# EasyEDA Pro project ProPrj_蓝牙_KICAD_2026-03-27.epro

# Schematic 蓝牙
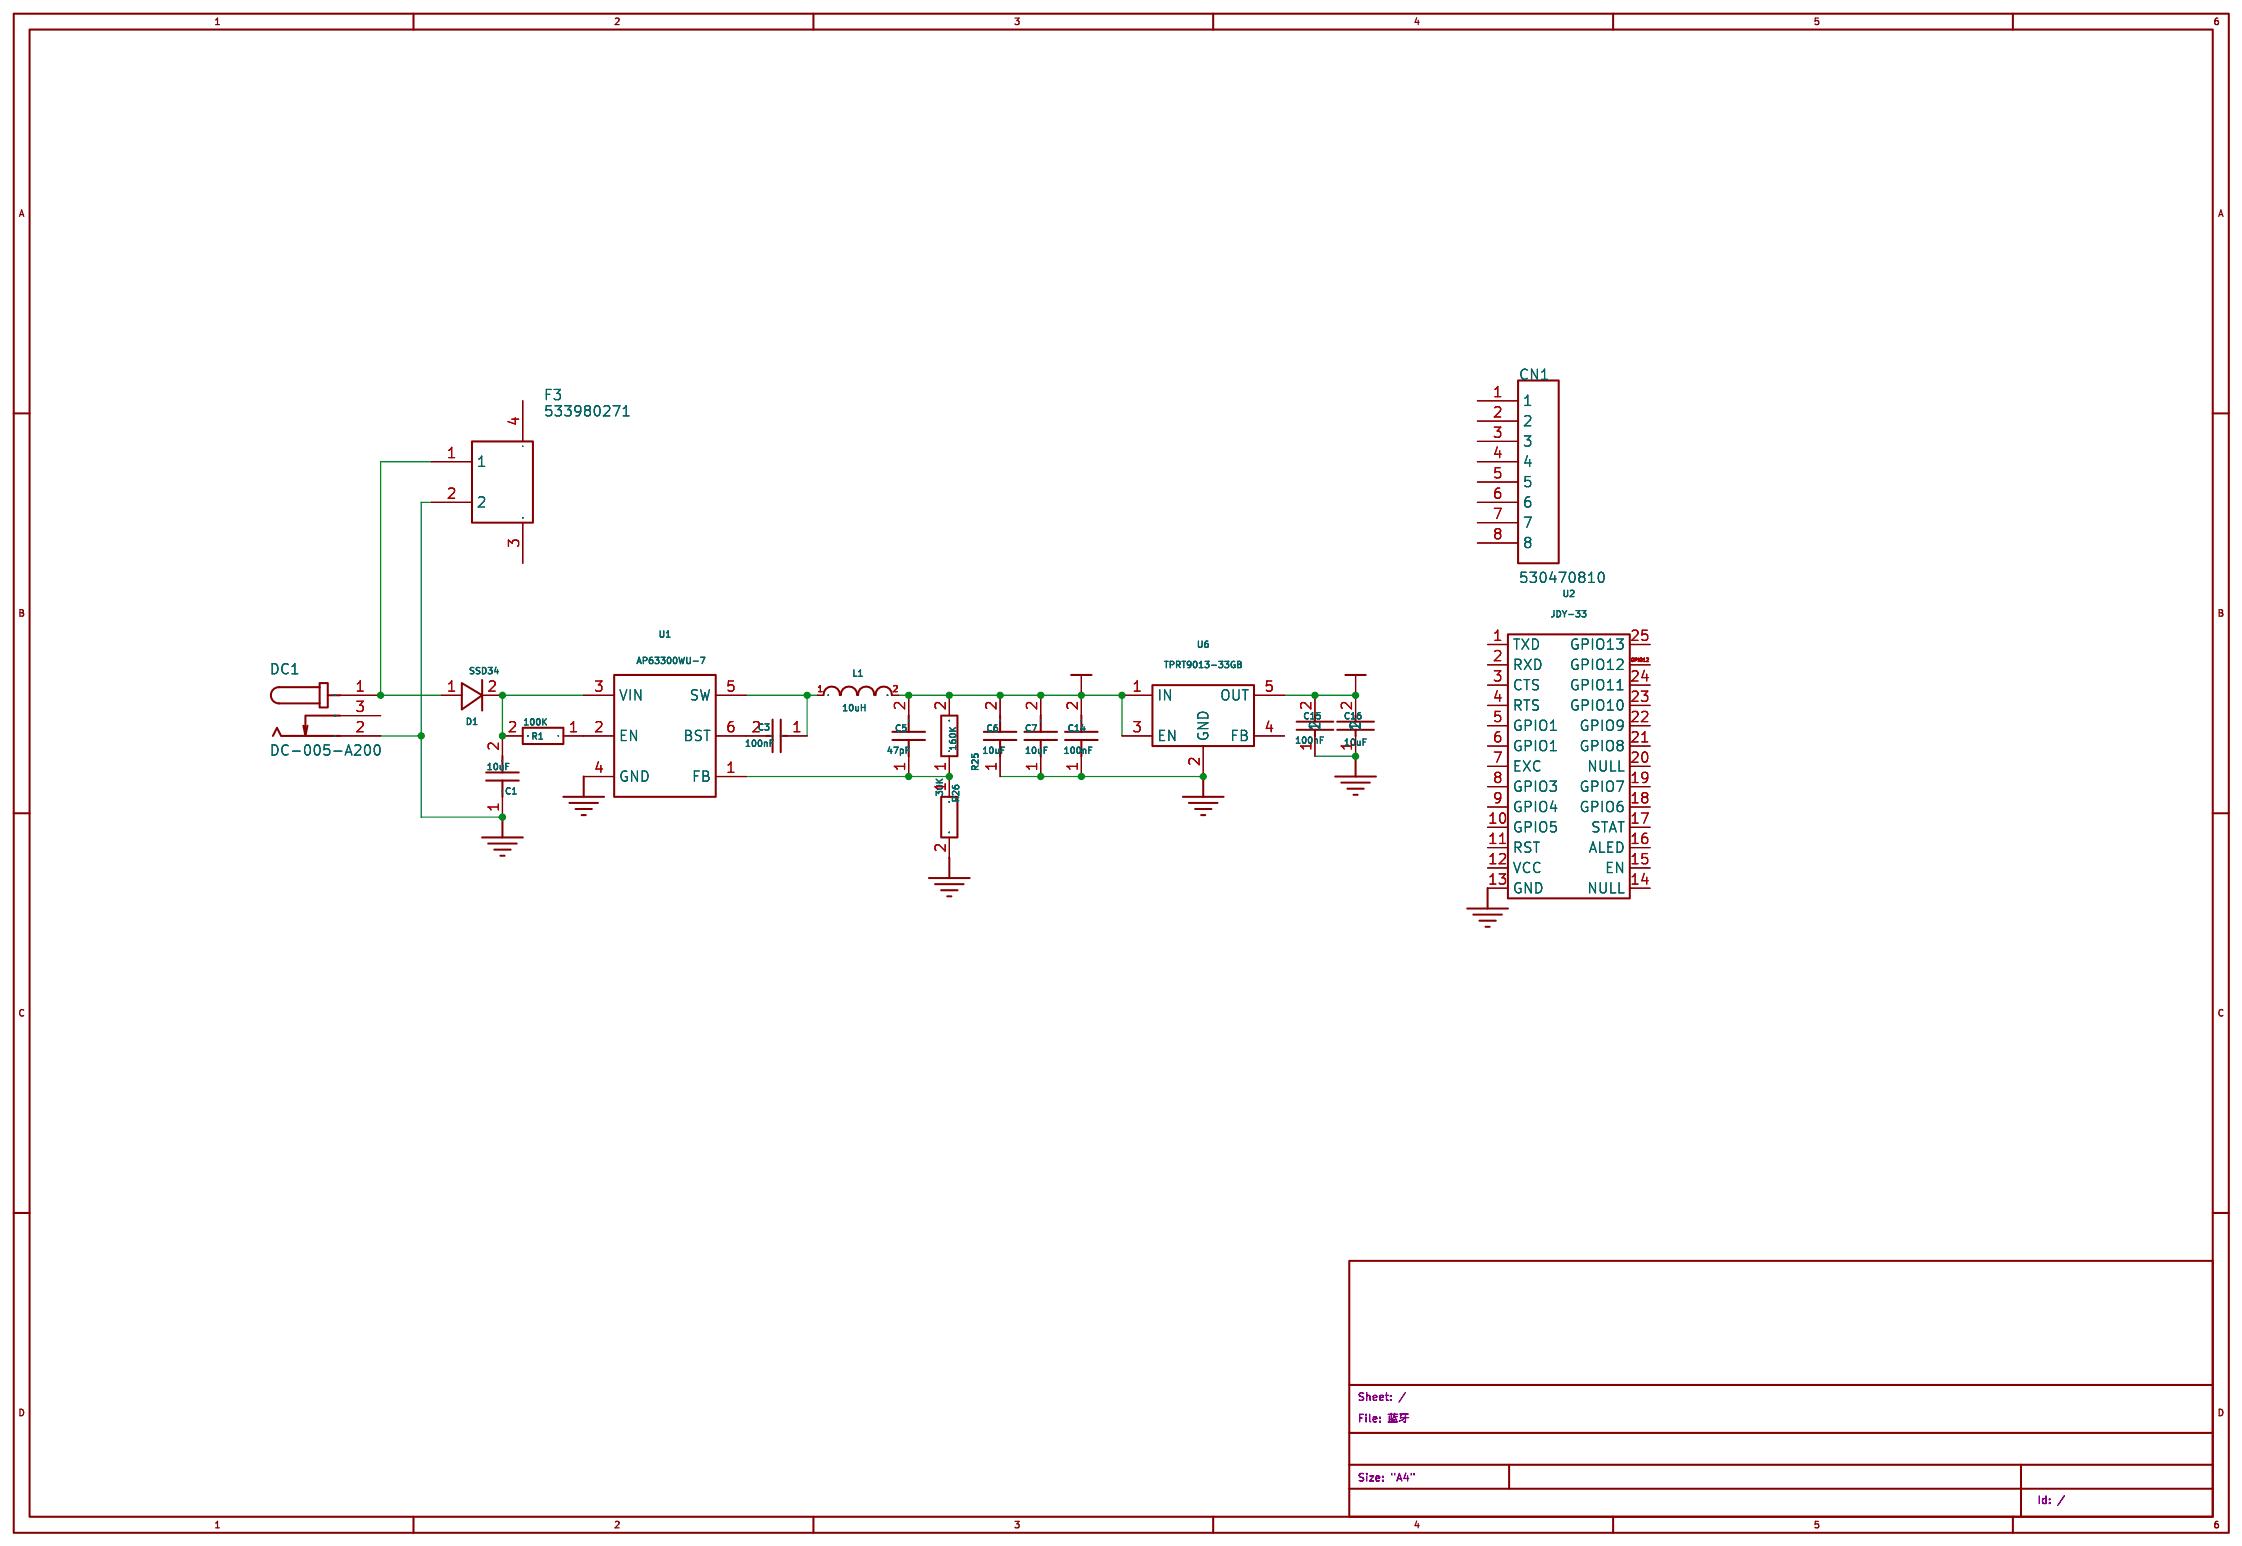
[diagram p0: schematic sheet]

## Parts
C1  10uF
C3  100nF
C5  47pF
C6  10uF
C7  10uF
C14  100nF
C15  100nF
C16  10uF
CN1  530470810  [CONN-TH_8P-P1.25_53047-0810]
D1  SSD34
DC1  DC-005-A200  [DC-IN-TH_DC-005-A200]
F3  533980271  [CONN-SMD_2P-P1.25_053398-0X71]
L1  10uH
R1  100K
R25  160K
R26  30K
U1  AP63300WU-7
U2  JDY-33
U6  TPRT9013-33GB

## Library data of the parts
C1 C5-C7 C14 = P1-altium-import_root_1_22uF_: ORIGIN FOOTPRINT: C0805_S; DEVICE: 22uF; SYMBOL: 22uF; SUPPLIER: LCSC; SUPPLIER PART: C602037; MANUFACTURER: SAMSUNG(三星); MANUFACTURER PART: CL21A226MAYNNNE; JLCPCB PART CLASS: Extended Part; LINK: https://so.szlcsc.com/global.html?k=C602037&amp;ref=editor; CONVERT TO PCB: yes; ADD INTO BOM: yes
C3 = P1-altium-import_root_3_0603B104K500NT_: 容值:100nF;精度:±10%;额定电压:50V;材质(温度系数):X7R;; 容值:100nF;精度:±10%;额定电压:50V;材质(温度系数):X7R;; PIN TYPE: IN; SYMBOL: C0603_S; DEVICE: 0603B104K500NT; CHECK: true; LCSC PART NAME: 100nF ±10% 50V; SUPPLIERPART: C30926; MANUFACTURER: FH(风华); MANUFACTURERPART: 0603B104K500NT; SUPPLIER FOOTPRINT: 0603; JLCPCB PART CLASS: Extended Part; DATASHEET: https://atta.szlcsc.com/upload/public/pdf/source/20200305/C486355_26A10D38EF8C2A5C37091D0039909270.pdf; SUPPLIER: LCSC; ADDINBOM: yes; CONVERTTOPCB: yes; FOOTPRINTNAME: C0603; MODELID: ac125912035d415993ca9572d50418b1; MODELNAME: C0603_L1.6-W0.8-H0.8; MODELTRANSFORM: 62.992,31.496,0,0,0,0,0,0,0; TOLERANCE: ±10%; VOLTAGE RATED: 50V; TEMPERATURE COEFFICIENT: X7R
C15 C16 = Diam_Recv-altium-import_2_C
CN1 = 530470810: 插针结构:1x8P;间距:1.25mm;安装方式:直插;参考系列:PicoBlade(MX 1.25);总PIN数:8P;排数:1;每排PIN数:8;行距:-;额定电流:1A;触头材质:磷青铜;触头镀层:锡;工作温度:-40℃~+85℃;; LCSC Part Name: 1x8P 间距:1.25mm 直插 系列:PicoBlade(MX 1.25); Supplier Part: C240845; Manufacturer: MOLEX; Supplier Footprint: 插件,P=1.25mm; JLCPCB Part Class: Extended Part; Datasheet: https://www.molex.com/content/dam/molex/molex-dot-com/products/automated/en-us/salesdrawingpdf/530/53047/530470810_sd.pdf?inline; Supplier: LCSC; Pins Structure: 1x8P; Pitch: 1.25mm; Mounting Type: 直插; Reference Series: PicoBlade(MX 1.25); Number of Pins: 8P; Number of Rows: 1; Number of PINs Per Row: 8; Current Rating: 1A; Contact Material: 磷青铜; Contact Plating: 锡; Operating Temperature: -40℃~+85℃; Voltage Rating: 125V; Plastic Material: PA; Flame Retardant Rating: UL94V-0; Color: 白色; Z-Height of the Board: 4.2mm; X-Length of Bottom Edge on Board (Spacing Line): 11.75mm; Y-Width of Bottom Edge on Board: 3.2mm
D1 = User_1N4148: 二极管
DC1 = DC-005-A200: 连接器类型:DC电源插座;安装方式:弯插;触点内径:2mm;触点外径:6.4mm;额定电流:3A;额定电压:30V;工作温度:-20℃~+70℃;; LCSC Part Name: DC电源插座 内径:2mm 外径:6.4mm; Supplier Part: C720557; Manufacturer: XUNPU(讯普); Supplier Footprint: 插件; JLCPCB Part Class: Extended Part; Datasheet: https://item.szlcsc.com/datasheet/DC-005-A200/763564.html; Supplier: LCSC; Connector Type: DC电源插座; Mounting Type: 弯插; Inside Contact Diameter: 2mm; Outside Contact Diameter: 6.4mm; Current Rating: 3A; Voltage Rating (Max): 30V; Operating Temperature: -20℃~+70℃
F3 = 533980271_C122410: 插针结构:1x2P;间距:1.25mm;安装方式:立贴;参考系列:PicoBlade(MX 1.25);总PIN数:2P;排数:1;每排PIN数:2;行距:-;额定电流:1A;触头材质:磷青铜;触头镀层:锡;工作温度:-40℃~+105℃;; LCSC Part Name: 1x2P 间距:1.25mm 立贴 系列:PicoBlade(MX 1.25); Supplier Part: C122410; Manufacturer: MOLEX; Supplier Footprint: SMD,P=1.25mm; JLCPCB Part Class: Extended Part; Datasheet: https://www.molex.com/content/dam/molex/molex-dot-com/products/automated/en-us/salesdrawingpdf/533/53398/533980271_sd.pdf?inline; Supplier: LCSC; Pins Structure: 1x2P; Pitch: 1.25mm; Mounting Type: 立贴; Reference Series: PicoBlade(MX 1.25); Number of Pins: 2P; Number of Rows: 1; Number of PINs Per Row: 2; Current Rating: 1A; Contact Material: 磷青铜; Contact Plating: 锡; Operating Temperature: -40℃~+105℃; Voltage Rating: 125V; Plastic Material: 玻纤增强PA; Flame Retardant Rating: UL94V-0; Supplementary Features: 辅助焊脚; Color: 白色; Z-Height of the Board: 4.7mm; X-Length of Bottom Edge on Board (Spacing Line): 7.65mm; Y-Width of Bottom Edge on Board: 4.2mm
L1 = P1-altium-import_root_0_22uH_
R1 = P1-altium-import_root_2_100K_: ORIGIN FOOTPRINT: R0402_S; SUPPLIER: LCSC; MANUFACTURER: YAGEO(国巨); MANUFACTURER PART: RC0402FR-0710KL; SUPPLIER PART: C60491; JLCPCB PART CLASS: Extended Part; RESISTANCE: 10kΩ; CONVERT TO PCB: yes; ADD INTO BOM: yes
R25 = P1-altium-import_root_0_28kΩ_: ORIGIN FOOTPRINT: R0402_S; DEVICE: 28kΩ; SYMBOL: 28kΩ; SUPPLIER: LCSC; MANUFACTURER: UNI-ROYAL(厚声); MANUFACTURER PART: 0402WGF2802TCE; SUPPLIER PART: C25772; JLCPCB PART CLASS: Extended Part; LINK: https://so.szlcsc.com/global.html?k=C25772&amp;ref=editor; CONVERT TO PCB: yes; ADD INTO BOM: yes
R26 = P1-altium-import_root_0_2kΩ_: ORIGIN FOOTPRINT: R0402_S; DEVICE: 2kΩ; SYMBOL: 2kΩ; SUPPLIER: LCSC; MANUFACTURER PART: 0402WGF2001TCE; MANUFACTURER: UNI-ROYAL(厚声); SUPPLIER PART: C4109; JLCPCB PART CLASS: Basic Part; LINK: https://so.szlcsc.com/global.html?k=C4109&amp;ref=editor; CONVERT TO PCB: yes; ADD INTO BOM: yes
U1 = User_AP63300: DC/DC
U2 = User_JDY-33
U6 = User_SGM2036: LDO

## Nets
P1-ALTIUM-IMPORT_GND_POWER_GROUND: C1.1 C6.1 C7.1 C14.1 C15.1 C16.1 DC1.2 F3.2 R26.2 U1.4(GND) U2.13(GND) U6.2(GND)
SELF_5V: C5.2 C6.2 C7.2 C14.2 L1.2 R25.2 U6.1(IN) U6.3(EN)
USER_3V3D: C15.2 C16.2 U6.5(OUT)
Net-(C1-2): C1.2 D1.2 R1.2 U1.3(VIN)
Net-(C3-1): C3.1 L1.1 U1.5(SW)
Net-(C3-2): C3.2 U1.6(BST)
Net-(C5-1): C5.1 R25.1 R26.1 U1.1(FB)
Net-(D1-1): D1.1 DC1.1 F3.1
Net-(R1-1): R1.1 U1.2(EN)

Not connected (* = marked no-connect by the designer): CN1 1 2 3 4 5 6 7 8; DC1 3; F3 3 4; U2 1(TXD) 2(RXD) 3(CTS) 4(RTS) 5(GPIO1) 6(GPIO1) 7(EXC) 8(GPIO3) 9(GPIO4) 10(GPIO5) 11(RST) 12(VCC) 14(NULL) 15(EN) 16(ALED) 17(STAT) 18(GPIO6) 19(GPIO7) 20(NULL) 21(GPIO8) 22(GPIO9) 23(GPIO10) 24(GPIO11) 25(GPIO13) GPIO12; U6 4(FB)
